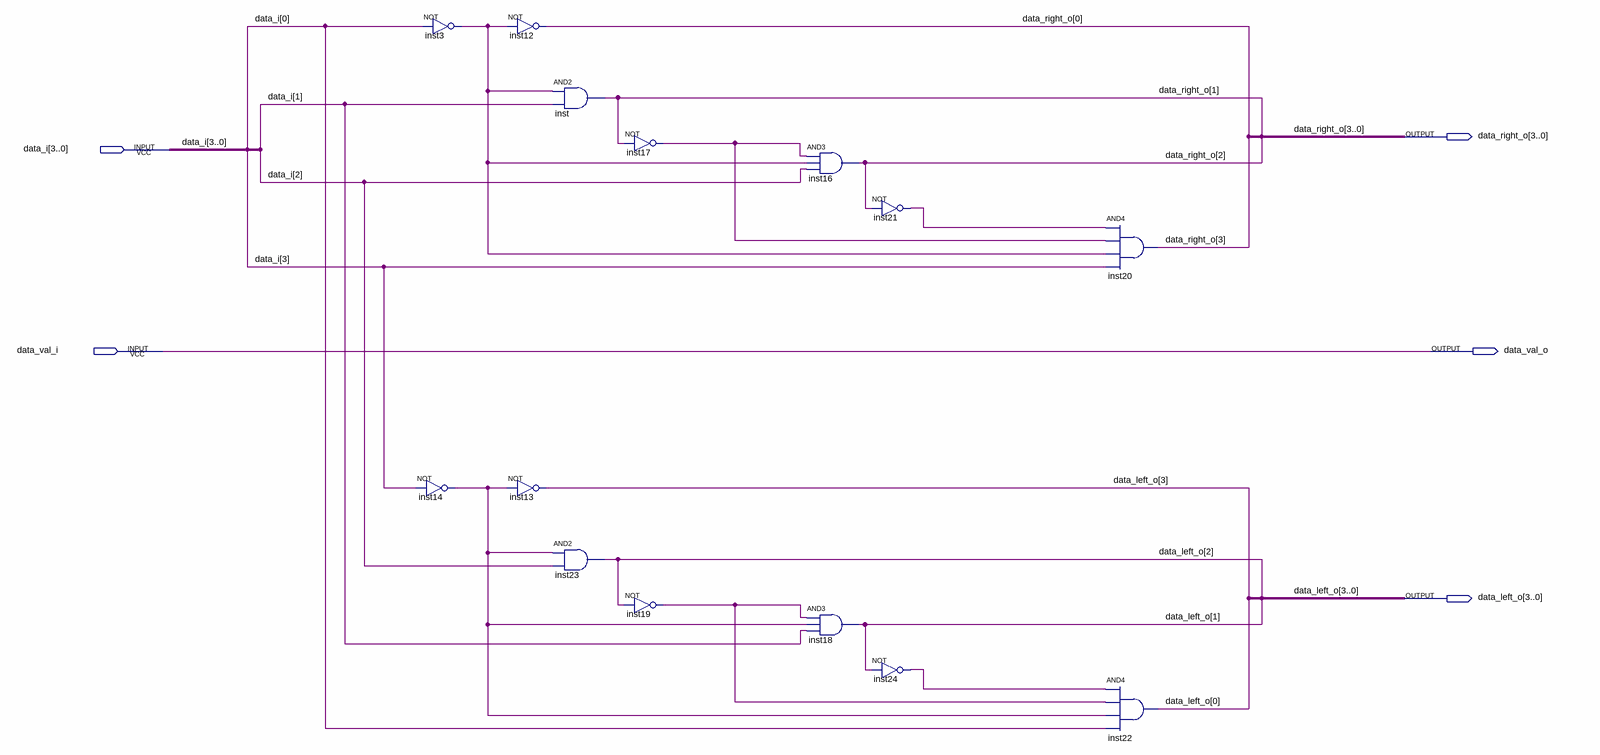
[diagram p0: schematic sheet]
// Quartus schematic outer1bits.bdf as structural Verilog: 14 symbols, 5 pins
module outer1bits (
  input  [3:0] data_i,
  input  data_val_i,
  output [3:0] data_right_o,
  output data_val_o,
  output [3:0] data_left_o
);

  wire inst3_out, inst14_out, inst17_out, inst19_out, inst21_out, inst24_out;

  not inst3 (inst3_out, data_i[0]);
  not inst14 (inst14_out, data_i[3]);
  not inst12 (data_right_o[0], inst3_out);
  not inst13 (data_left_o[3], inst14_out);
  and inst (data_right_o[1], inst3_out, data_i[1]);
  and inst23 (data_left_o[2], inst14_out, data_i[2]);
  not inst17 (inst17_out, data_right_o[1]);
  not inst19 (inst19_out, data_left_o[2]);
  and inst16 (data_right_o[2], inst17_out, inst3_out, data_i[2]);
  and inst18 (data_left_o[1], inst19_out, inst14_out, data_i[1]);
  not inst21 (inst21_out, data_right_o[2]);
  not inst24 (inst24_out, data_left_o[1]);
  and inst20 (data_right_o[3], inst21_out, inst17_out, inst3_out, data_i[3]);
  and inst22 (data_left_o[0], inst24_out, inst19_out, inst14_out, data_i[0]);

  assign data_val_o = data_val_i;
endmodule
